# EasyEDA schematic 1-Schematic_ESP_nand.json
TITLE: Sheet_1; REV: 1.0; Date: 2025-05-09; Sheet: 1/1; Drawn By: rp6conrad; Company: Your Company
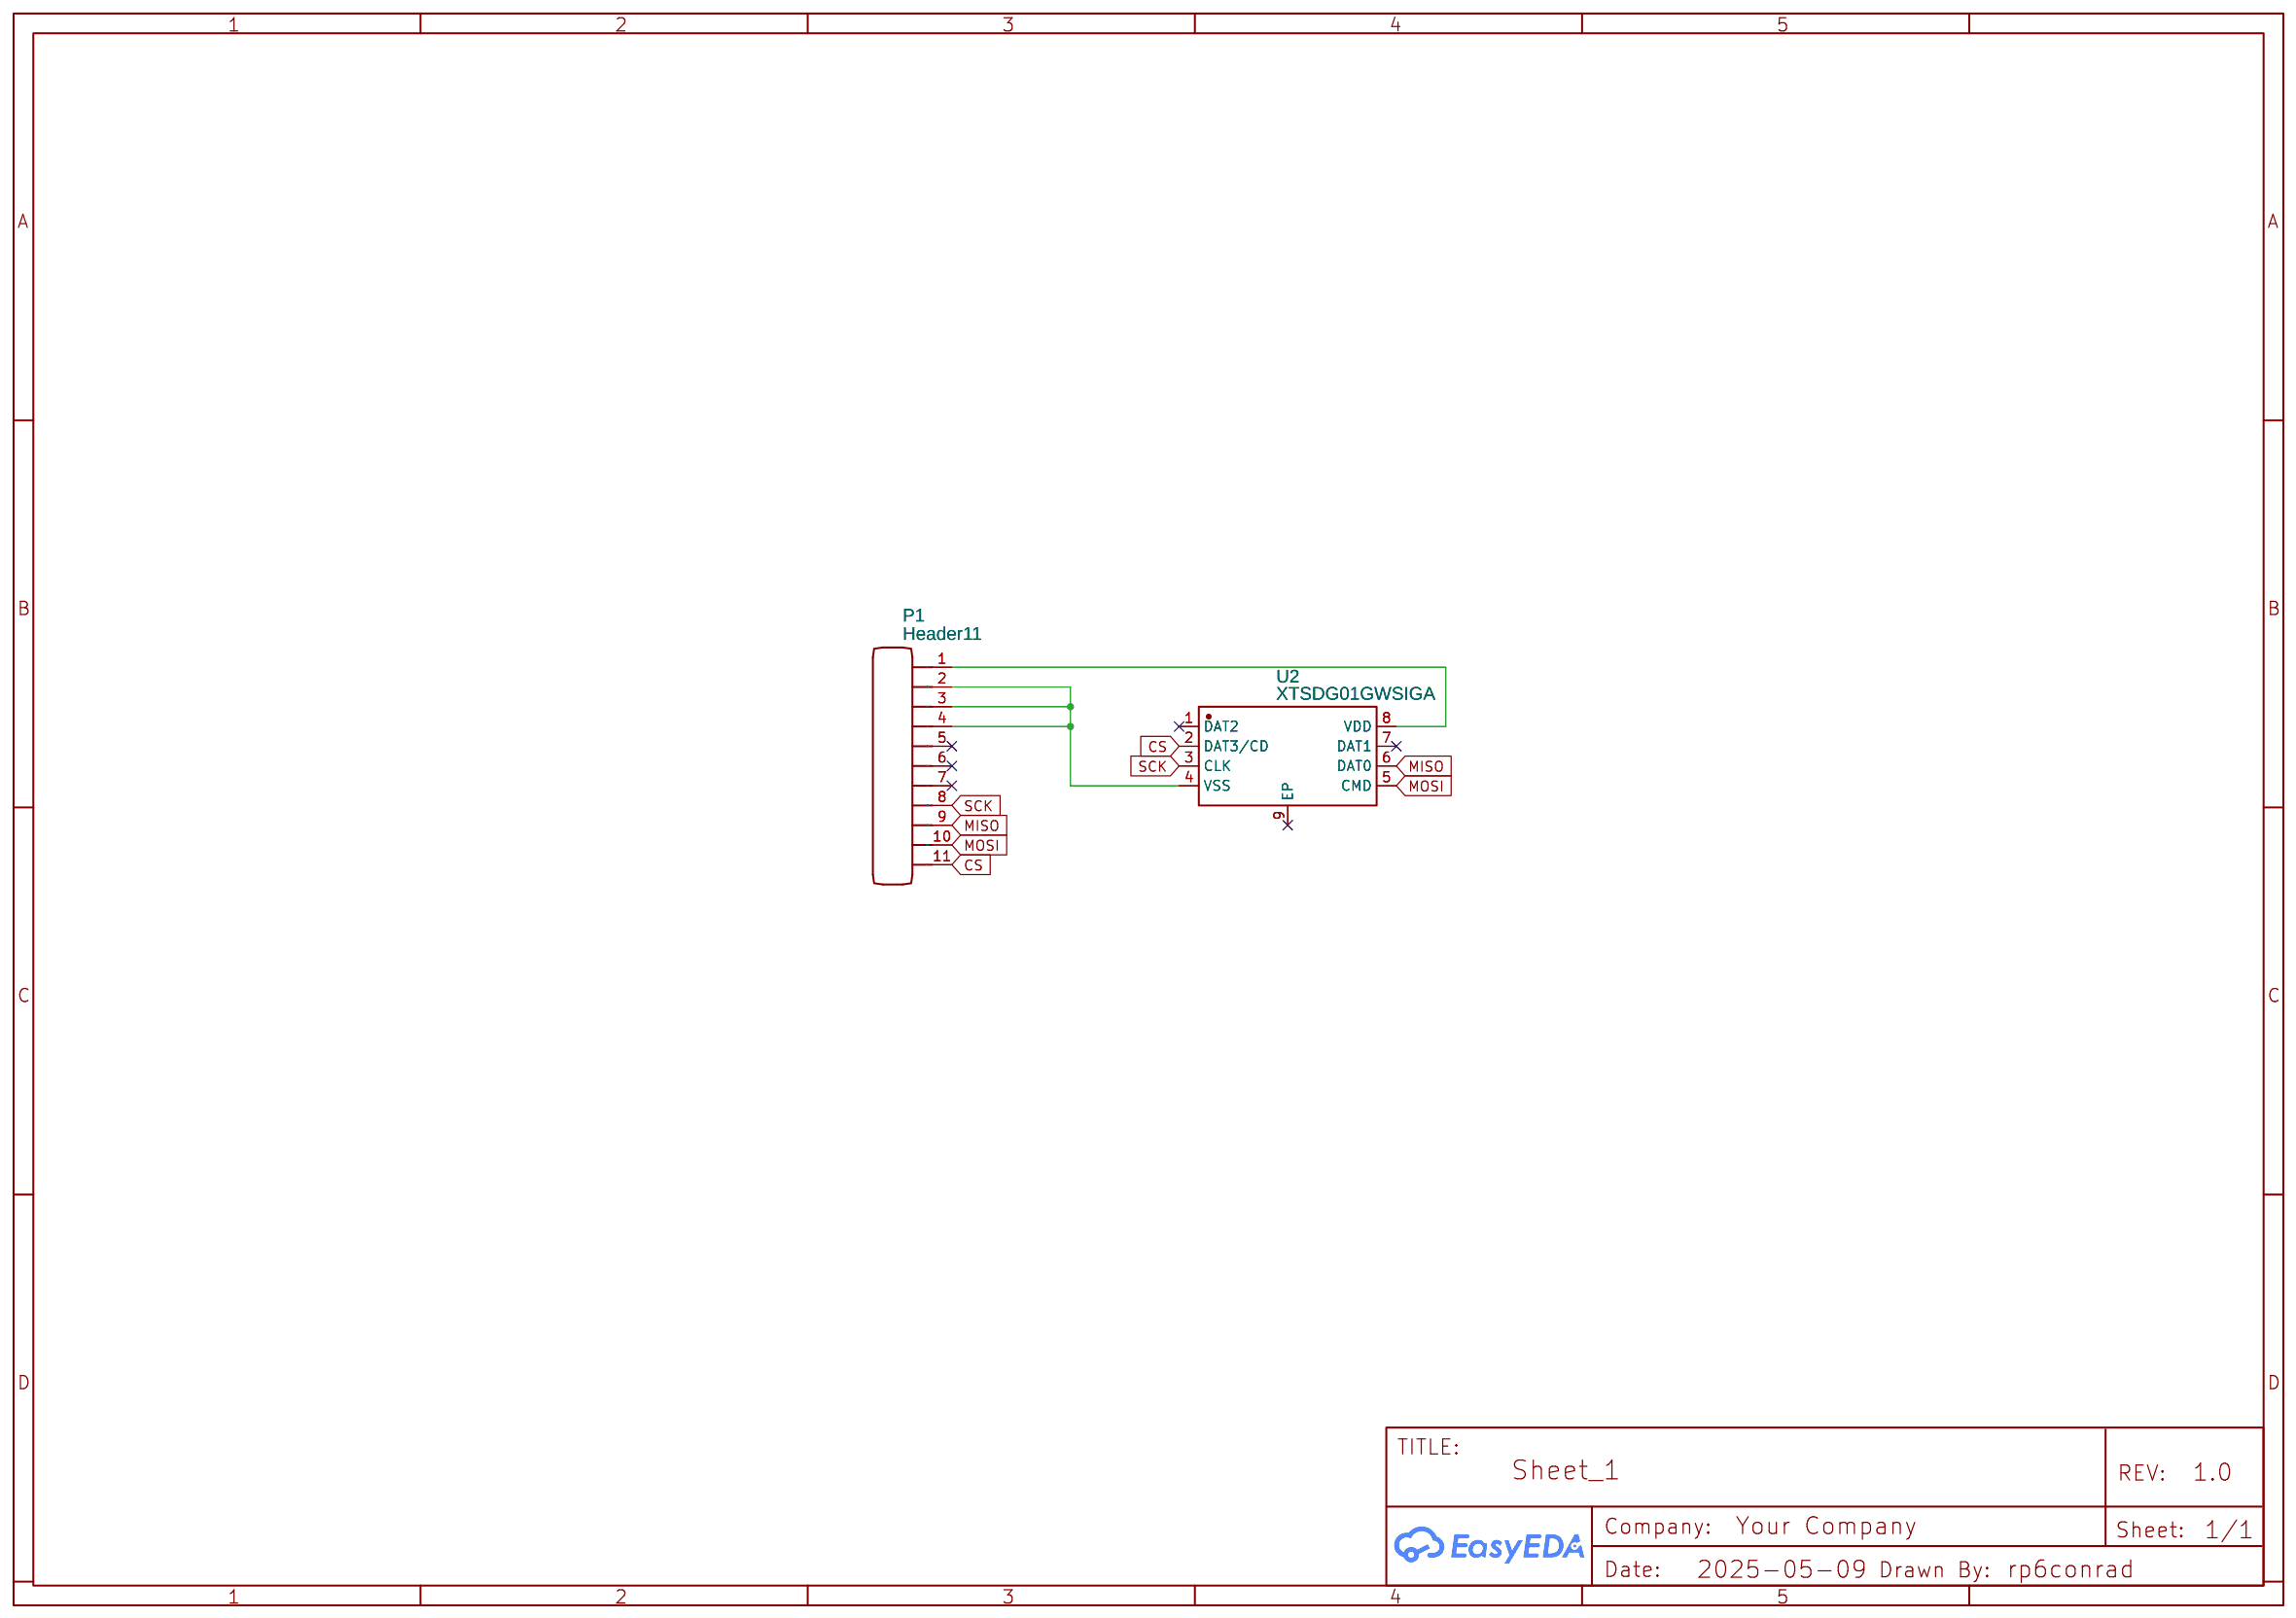
[diagram p0: schematic sheet]

## Parts
P1  Header11  [HEADER11_25]
U2  XTSDG01GWSIGA  [WSON-8_L8.0-W6.0-P1.27-BL-EP-1]

## Library data of the parts
P1 = Header11: Contributor: RayGD; Package Display: No
U2 = XTSDG01GWSIGA: Supplier: LCSC; Supplier Part: C7429710; Manufacturer: XTX(芯天下); JLCPCB Part Class: Extended Part; Contributor: lcsc

## Nets
CS: P1.11 U2.2(DAT3/CD)
MISO: P1.9 U2.6(DAT0)
MOSI: P1.10 U2.5(CMD)
SCK: P1.8 U2.3(CLK)
Net-(P1-1): P1.1 U2.8(VDD)
Net-(P1-2): P1.2 P1.3 P1.4 U2.4(VSS)

Not connected (* = marked no-connect by the designer): P1 5* 6* 7*; U2 1(DAT2)* 7(DAT1)* 9(EP)*
